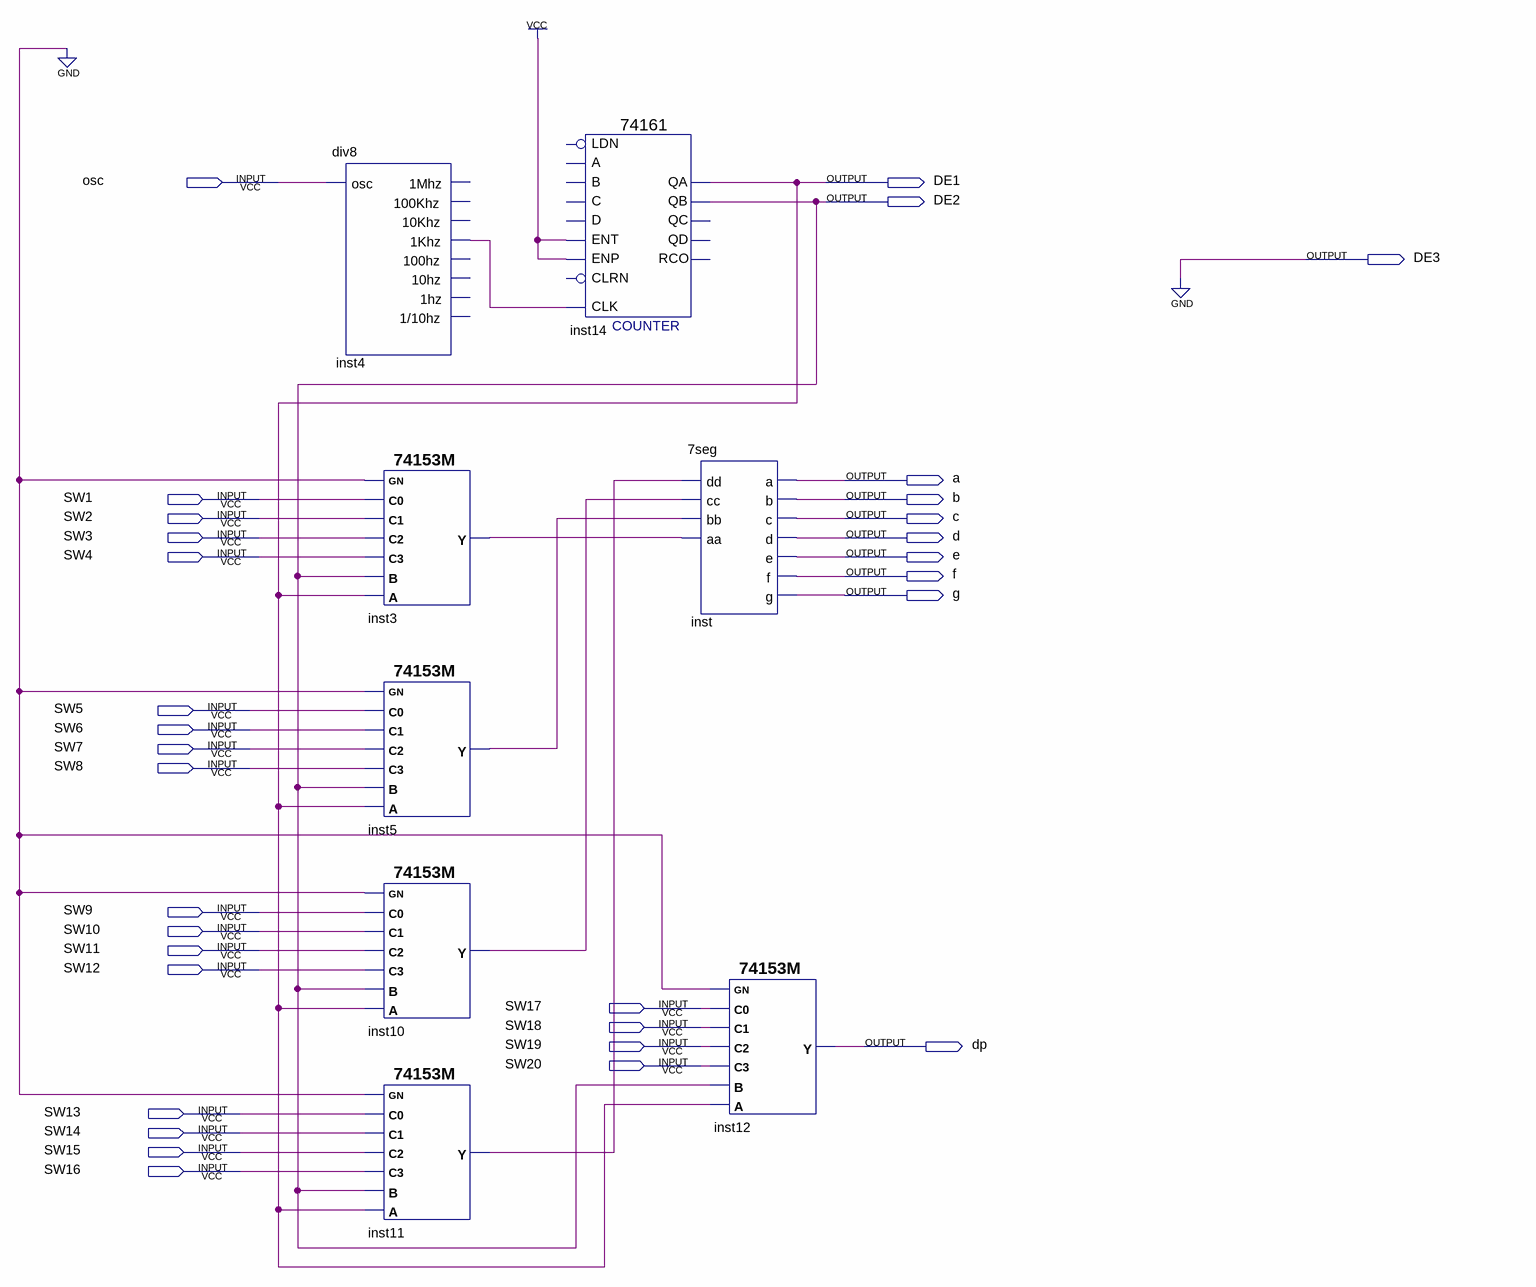
[diagram p0: schematic sheet]
// Quartus schematic seg7.bdf as structural Verilog: 8 symbols, 32 pins
module seg7 (
  input  osc,
  input  SW1,
  input  SW2,
  input  SW3,
  input  SW4,
  input  SW5,
  input  SW6,
  input  SW7,
  input  SW8,
  input  SW9,
  input  SW10,
  input  SW11,
  input  SW12,
  input  SW17,
  input  SW18,
  input  SW19,
  input  SW20,
  input  SW13,
  input  SW14,
  input  SW15,
  input  SW16,
  output DE1,
  output DE2,
  output DE3,
  output a,
  output b,
  output c,
  output d,
  output e,
  output f,
  output g,
  output dp
);

  wire inst3_y, inst4_1khz, inst5_y, inst10_y, inst11_y;

  div8 inst4 (.osc(osc), .\1Khz (inst4_1khz));  // open: 1Mhz, 100Khz, 10Khz, 100hz, 10hz, 1hz, 1/10hz
  \74153M  inst3 (.A(DE1), .B(DE2), .C3(SW4), .C2(SW3), .C1(SW2), .C0(SW1), .GN(1'b0), .Y(inst3_y));
  \74153M  inst5 (.A(DE1), .B(DE2), .C3(SW8), .C2(SW7), .C1(SW6), .C0(SW5), .GN(1'b0), .Y(inst5_y));
  \74153M  inst10 (.A(DE1), .B(DE2), .C3(SW12), .C2(SW11), .C1(SW10), .C0(SW9), .GN(1'b0), .Y(inst10_y));
  \74153M  inst11 (.A(DE1), .B(DE2), .C3(SW16), .C2(SW15), .C1(SW14), .C0(SW13), .GN(1'b0), .Y(inst11_y));
  \74161  inst14 (
    .CLK(inst4_1khz), .ENP(1'b1), .ENT(1'b1), .QB(DE2), .QA(DE1));  // open: CLRN, LDN, A, D, B, C, QD, QC, RCO
  \7seg  inst (
    .dd(inst11_y), .cc(inst10_y), .bb(inst5_y), .aa(inst3_y), .a(a), .b(b), .c(c), .d(d), .e(e), .f(f), .g(g));
  \74153M  inst12 (.A(DE1), .B(DE2), .C3(SW20), .C2(SW19), .C1(SW18), .C0(SW17), .GN(1'b0), .Y(dp));

  assign DE3 = 1'b0;
endmodule
